# EAGLE schematic umodular_midi4_rev01 (EAGLE 7.2.0)
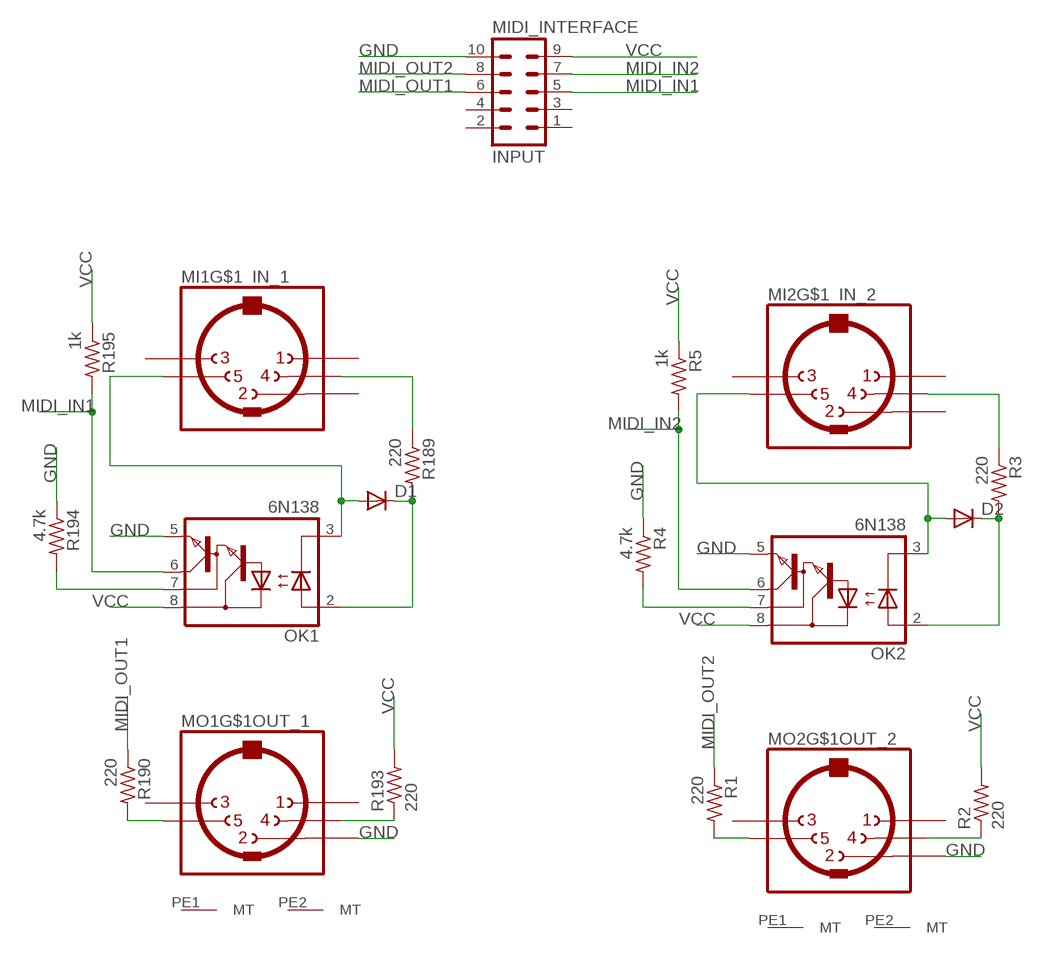
[diagram p0: schematic, sheet 1]

## Parts
D1  1N4148DO35-7  [DO35-7]
D2  1N4148DO35-7  [DO35-7]
MI1  IN_1  MIDIJACK  [CP-2350]
MI2  IN_2  MIDIJACK  [CP-2350]
MIDI_INTERFACE  INPUT  MA05-2  [MA05-2]
MO1  OUT_1  MIDIJACK  [CP-2350]
MO2  OUT_2  MIDIJACK  [CP-2350]
OK1  6N138  [DIL08]
OK2  6N138  [DIL08]
R1  220  R-US_0204/7  [0204/7@1]
R2  220  R-US_0204/7  [0204/7@1]
R3  220  R-US_0204/7  [0204/7@1]
R4  4.7k  R-US_0204/7  [0204/7@1]
R5  1k  R-US_0204/7  [0204/7@1]
R189  220  R-US_0204/7  [0204/7@1]
R190  220  R-US_0204/7  [0204/7@1]
R193  220  R-US_0204/7  [0204/7@1]
R194  4.7k  R-US_0204/7  [0204/7@1]
R195  1k  R-US_0204/7  [0204/7@1]

## Nets
GND: MIDI_INTERFACE.10 MO1.2 MO2.2 OK1.5(GND) OK2.5(GND) R4.1 R194.1
MIDI_IN1: MIDI_INTERFACE.5 OK1.6(VO) R195.2
MIDI_IN2: MIDI_INTERFACE.7 OK2.6(VO) R5.2
MIDI_OUT1: MIDI_INTERFACE.6 R190.1
MIDI_OUT2: MIDI_INTERFACE.8 R1.1
N$1: MO2.4 R2.1
N$2: MO2.5 R1.2
N$3: MI2.4 R3.1
N$4: D2.C OK2.2(A) R3.2
N$5: D2.A MI2.5 OK2.3(C)
N$6: OK2.7(VB) R4.2
N$330: MI1.4 R189.1
N$331: MO1.4 R193.1
N$332: MO1.5 R190.2
N$333: D1.C OK1.2(A) R189.2
N$336: D1.A MI1.5 OK1.3(C)
N$337: OK1.7(VB) R194.2
VCC: MIDI_INTERFACE.9 OK1.8(VCC) OK2.8(VCC) R2.2 R5.1 R193.2 R195.1
Unconnected: MI1.1 MI1.2 MI1.3 MI1.PE1(MT) MI1.PE2(MT) MI1.PE(MT) MI1.PE@(MT) MI2.1 MI2.2 MI2.3 MI2.PE1(MT) MI2.PE2(MT) MI2.PE(MT) MI2.PE@(MT) MIDI_INTERFACE.1 MIDI_INTERFACE.2 MIDI_INTERFACE.3 MIDI_INTERFACE.4 MO1.1 MO1.3 MO1.PE1(MT) MO1.PE2(MT) MO1.PE(MT) MO1.PE@(MT) MO2.1 MO2.3 MO2.PE1(MT) MO2.PE2(MT) MO2.PE(MT) MO2.PE@(MT)

## Library data of the parts
D1 D2 = diode:1N4148: DIODE high speed (Philips)
MI1 MI2 MO1 MO2 = adafruit:MIDIJACK: DIN 5 jack also known as MIDI jack A modification of conn-hirshman:MAB5SH with two options for the grounding 'teeth'
MIDI_INTERFACE = con-lstb:MA05-2: PIN HEADER; OC_FARNELL: unknown; OC_NEWARK: unknown
OK1 OK2 = optocoupler:6N138: MOTOROLA OPTO COUPLER; MF: VISHAY/TELEFUNKEN; MPN: 6N138; OC_FARNELL: 9860150; OC_NEWARK: 35K5294
R1-R5 R189 R190 R193-R195 = rcl:R-US_: RESISTOR, American symbol

## Net classes
0 default: width 0.305 mm